# EAGLE schematic ControlBoardV3-4L (EAGLE 6.5.0)

## Sheet 1 of 4
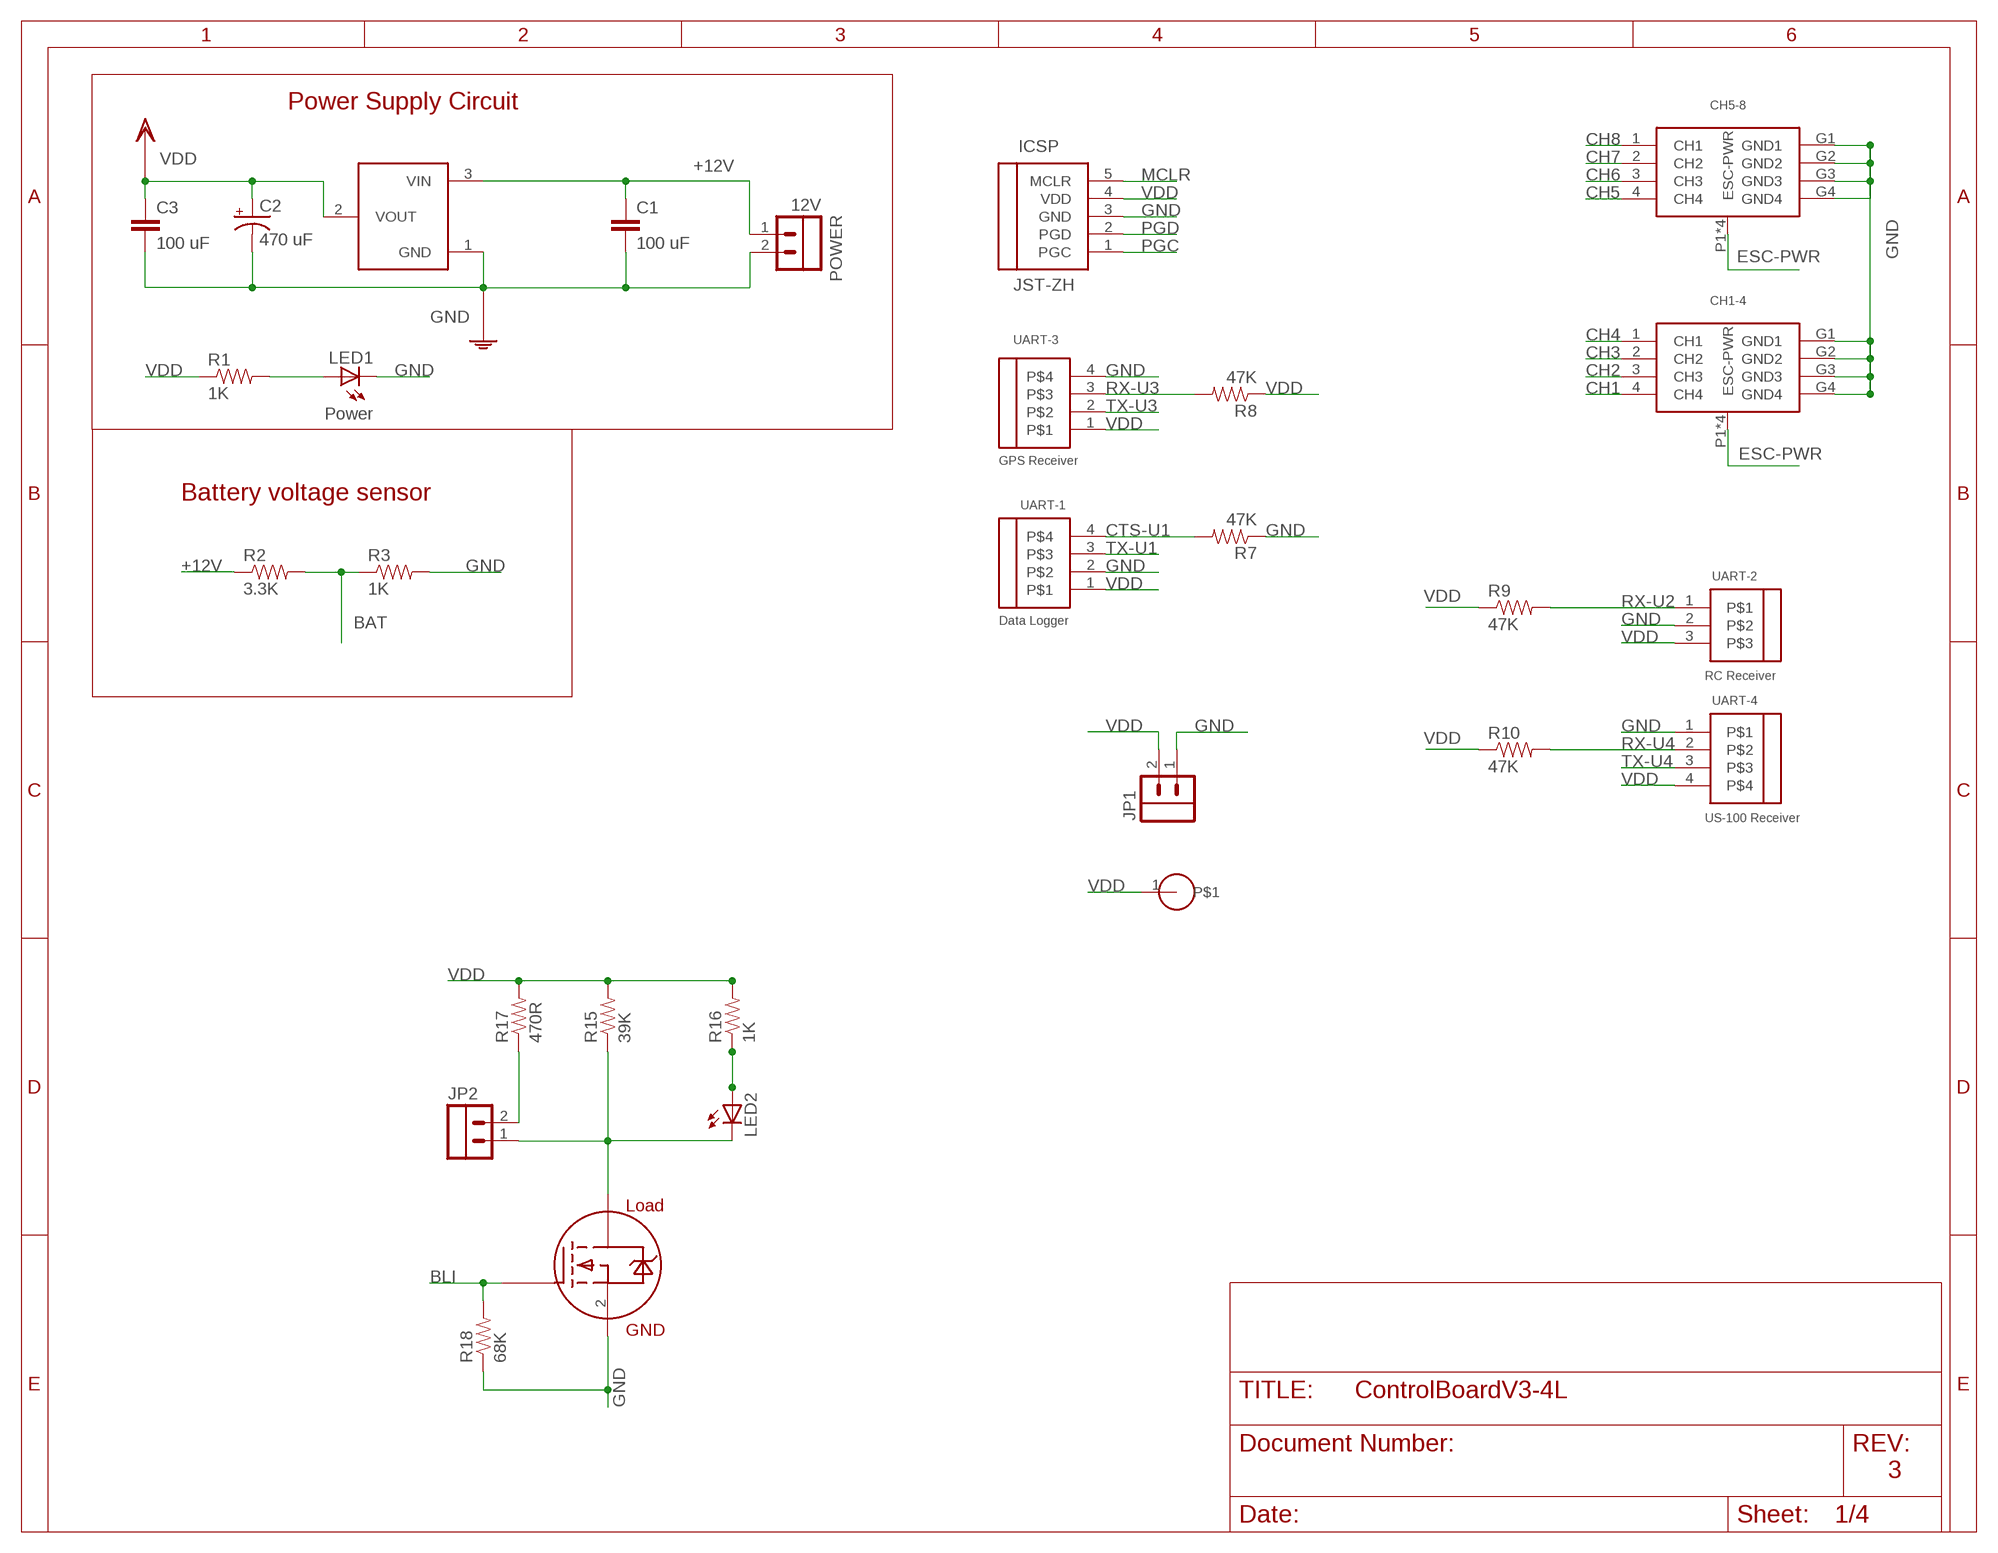
[diagram p0: schematic, sheet 1]

### Parts
C1  100 uF  CAP-CERAMIC_1210  [1210_INCH-HS-CAP]
C2  470 uF  CAP-SMD-TANT_D-7343  [TANT-D-7343]
C3  100 uF  CAP-CERAMIC_1210  [1210_INCH-HS-CAP]
CH1-4  4CH-PWM-PPM-HEADER  [4CH-PWM-PPM-HEADER-PACKAGE]
CH5-8  4CH-PWM-PPM-HEADER  [4CH-PWM-PPM-HEADER-PACKAGE]
ICSP  JST-ZH  ICSP_JST-ZH  [1X05-JST-ZH]
JP1  HEADER-02_JST_ZH  [1X02-JST-ZH]
JP2  HEADER-02_0.1"_NO_SILK  [1X02_100MIL_NO_SILK]
LED1  Power  LED_SMD_1206  [1206_INCH-HS-LED]
LED2  LED_SMD_1206  [1206_INCH-HS-LED]
POWER  12V  HEADER-02_0.1"_LONGPADS  [1X02_100MIL_LONGPADS]
R1  1K  RESISTOR_0805  [0805_INCH-HS]
R2  3.3K  RESISTOR_0805  [0805_INCH-HS]
R3  1K  RESISTOR_0805  [0805_INCH-HS]
R7  47K  RESISTOR_0805  [0805_INCH-HS]
R8  47K  RESISTOR_0805  [0805_INCH-HS]
R9  47K  RESISTOR_0805  [0805_INCH-HS]
R10  47K  RESISTOR_0805  [0805_INCH-HS]
R15  39K  RESISTOR_0805  [0805_INCH-HS]
R16  1K  RESISTOR_0805  [0805_INCH-HS]
R17  470R  RESISTOR_0805  [0805_INCH-HS]
R18  68K  RESISTOR_0805  [0805_INCH-HS]
U$2  NCP1117_DPAK  [DPAK-ONSEMI]
U$5  N-MOSFET_SOT-323  [SOT-323]
U$6  TAP-01_PRECISE  [1X01_PRECISE]
UART-1  Data Logger  HEADER-04_JST-ZH_JST-ZH  [1X04-JST-ZH]
UART-2  RC Receiver  HEADER-03_JST-ZH  [1X03-JST-ZH]
UART-3  GPS Receiver  HEADER-04_MOLEX-1.25  [1X04-MOLEX-PICOBLADE]
UART-4  US-100 Receiver  HEADER-04_JST-ZH_JST-ZH  [1X04-JST-ZH]

### Nets
+12V [Power]: C1.P$1 POWER.1 R2.1 U$2.3(VIN)
BAT: R2.2 R3.1 ; also sheet 2
BLI: R18.2 U$5.1(G) ; also sheet 2
CH1: CH1-4.4(CH4) ; also sheet 2
CH2: CH1-4.3(CH3) ; also sheet 2
CH3: CH1-4.2(CH2) ; also sheet 2
CH4: CH1-4.1(CH1) ; also sheet 2
CH5: CH5-8.4(CH4) ; also sheet 2
CH6: CH5-8.3(CH3) ; also sheet 2
CH7: CH5-8.2(CH2) ; also sheet 2
CH8: CH5-8.1(CH1) ; also sheet 2
CTS-U1: R7.2 UART-1.4 ; also sheet 2
ESC-PWR: CH1-4.P1(ESC-PWR) CH1-4.P2(ESC-PWR) CH1-4.P3(ESC-PWR) CH1-4.P4(ESC-PWR) CH5-8.P1(ESC-PWR) CH5-8.P2(ESC-PWR) CH5-8.P3(ESC-PWR) CH5-8.P4(ESC-PWR)
GND: C1.P$2 C2.- C3.P$2 CH1-4.G1(GND1) CH1-4.G2(GND2) CH1-4.G3(GND3) CH1-4.G4(GND4) CH5-8.G1(GND1) CH5-8.G2(GND2) CH5-8.G3(GND3) CH5-8.G4(GND4) ICSP.3(GND) JP1.1 LED1.C POWER.2 R3.2 R7.1 R18.1 U$2.1(GND) U$5.2(S) UART-1.2 UART-2.2 UART-3.4 UART-4.1 ; also sheet 2,3,4
MCLR: ICSP.5(MCLR) ; also sheet 2
N$2: LED1.A R1.2
N$11: JP2.2 R17.1
N$12: JP2.1 LED2.C R15.1 U$5.3(D)
N$13: LED2.A R16.1
PGC: ICSP.1(PGC) ; also sheet 2
PGD: ICSP.2(PGD) ; also sheet 2
RX-U2: R9.2 UART-2.1 ; also sheet 2
RX-U3: R8.2 UART-3.3 ; also sheet 2
RX-U4: R10.2 UART-4.2 ; also sheet 2
TX-U1: UART-1.3 ; also sheet 2
TX-U3: UART-3.2 ; also sheet 2
TX-U4: UART-4.3 ; also sheet 2
VDD: C2.+ C3.P$1 ICSP.4(VDD) JP1.2 R1.1 R8.1 R9.1 R10.1 R15.2 R16.2 R17.2 U$2.2(VOUT) U$6.1 UART-1.1 UART-2.3 UART-3.1 UART-4.4 ; also sheet 2,3,4

### Notes on the sheet
- Power Supply Circuit
- Battery voltage sensor
- 3

## Sheet 2 of 4
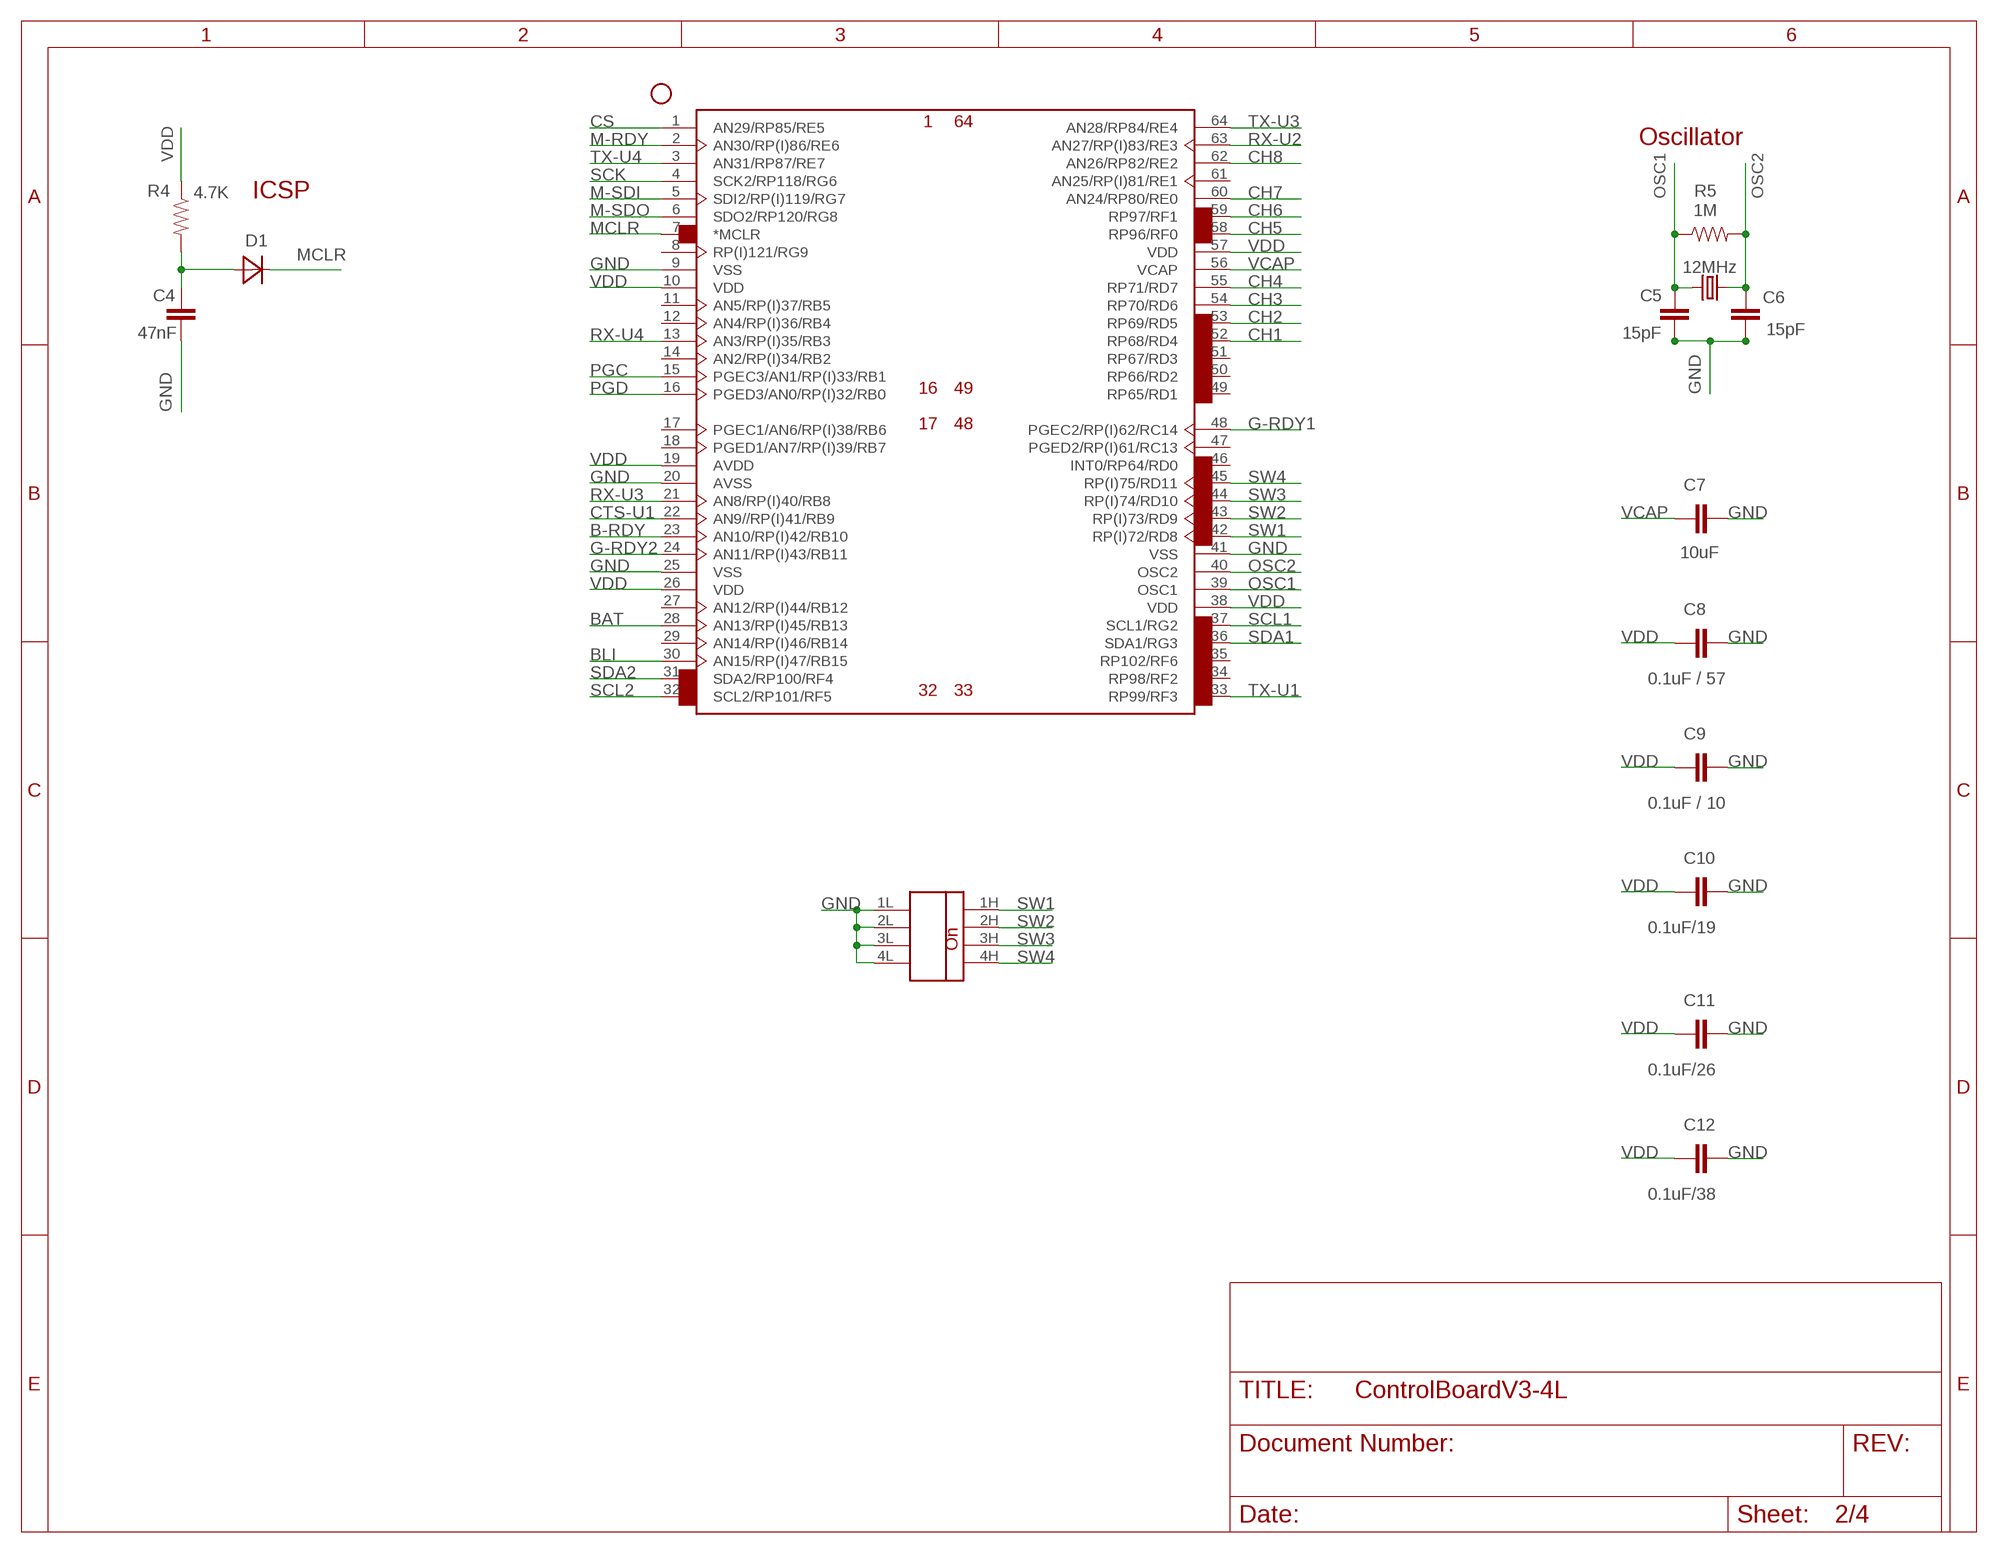
[diagram p1: schematic, sheet 2]

### Parts
C4  47nF  CAP-CERAMIC_0805  [0805_INCH-HS-CAP]
C5  15pF  CAP-CERAMIC_0805  [0805_INCH-HS-CAP]
C6  15pF  CAP-CERAMIC_0805  [0805_INCH-HS-CAP]
C7  10uF  CAP-CERAMIC_1210  [1210_INCH-HS-CAP]
C8  0.1uF / 57  CAP-CERAMIC_0603  [0603_INCH-HS-CAP]
C9  0.1uF / 10  CAP-CERAMIC_0603  [0603_INCH-HS-CAP]
C10  0.1uF/19  CAP-CERAMIC_0603  [0603_INCH-HS-CAP]
C11  0.1uF/26  CAP-CERAMIC_0603  [0603_INCH-HS-CAP]
C12  0.1uF/38  CAP-CERAMIC_0603  [0603_INCH-HS-CAP]
D1  DIODE_1206  [1206_INCH-HS-DIODE]
Q1  12MHz  CRYSTAL_SMD-5.0X3.2  [CRYSTAL-SMD-5.0X3.2]
R4  4.7K  RESISTOR_0805  [0805_INCH-HS]
R5  1M  RESISTOR_0805  [0805_INCH-HS]
U$1  PIC24EP512GP806_TQFP64-10X10  [TQFP64-10X10X1MM]
U$3  SWITCH-4_HALF-PITCH  [DIP-4-HP]

### Nets
B-RDY: U$1.23(AN10/RP(I)42/RB10) ; also sheet 4
BAT: U$1.28(AN13/RP(I)45/RB13) ; also sheet 1
BLI: U$1.30(AN15/RP(I)47/RB15) ; also sheet 1
CH1: U$1.52(RP68/RD4) ; also sheet 1
CH2: U$1.53(RP69/RD5) ; also sheet 1
CH3: U$1.54(RP70/RD6) ; also sheet 1
CH4: U$1.55(RP71/RD7) ; also sheet 1
CH5: U$1.58(RP96/RF0) ; also sheet 1
CH6: U$1.59(RP97/RF1) ; also sheet 1
CH7: U$1.60(AN24/RP80/RE0) ; also sheet 1
CH8: U$1.62(AN26/RP82/RE2) ; also sheet 1
CS: U$1.1(AN29/RP85/RE5) ; also sheet 3
CTS-U1: U$1.22(AN9//RP(I)41/RB9) ; also sheet 1
G-RDY1: U$1.48(PGEC2/RP(I)62/RC14) ; also sheet 3
G-RDY2: U$1.24(AN11/RP(I)43/RB11) ; also sheet 4
GND: C4.2 C5.1 C6.1 C7.P$2 C8.2 C9.2 C10.2 C11.2 C12.2 U$1.9(VSS) U$1.20(AVSS) U$1.25(VSS) U$1.41(VSS) U$3.1L U$3.2L U$3.3L U$3.4L ; also sheet 1,3,4
M-RDY: U$1.2(AN30/RP(I)86/RE6) ; also sheet 3
M-SDI: U$1.5(SDI2/RP(I)119/RG7) ; also sheet 3
M-SDO: U$1.6(SDO2/RP120/RG8) ; also sheet 3
MCLR: D1.C U$1.7(*MCLR) ; also sheet 1
N$14: C4.1 D1.A R4.2
OSC1: C5.2 Q1.P$2 R5.1 U$1.39(OSC1)
OSC2: C6.2 Q1.P$1 R5.2 U$1.40(OSC2)
PGC: U$1.15(PGEC3/AN1/RP(I)33/RB1) ; also sheet 1
PGD: U$1.16(PGED3/AN0/RP(I)32/RB0) ; also sheet 1
RX-U2: U$1.63(AN27/RP(I)83/RE3) ; also sheet 1
RX-U3: U$1.21(AN8/RP(I)40/RB8) ; also sheet 1
RX-U4: U$1.13(AN3/RP(I)35/RB3) ; also sheet 1
SCK: U$1.4(SCK2/RP118/RG6) ; also sheet 3
SCL1: U$1.37(SCL1/RG2) ; also sheet 3
SCL2: U$1.32(SCL2/RP101/RF5) ; also sheet 4
SDA1: U$1.36(SDA1/RG3) ; also sheet 3
SDA2: U$1.31(SDA2/RP100/RF4) ; also sheet 4
SW1: U$1.42(RP(I)72/RD8) U$3.1H
SW2: U$1.43(RP(I)73/RD9) U$3.2H
SW3: U$1.44(RP(I)74/RD10) U$3.3H
SW4: U$1.45(RP(I)75/RD11) U$3.4H
TX-U1: U$1.33(RP99/RF3) ; also sheet 1
TX-U3: U$1.64(AN28/RP84/RE4) ; also sheet 1
TX-U4: U$1.3(AN31/RP87/RE7) ; also sheet 1
VCAP: C7.P$1 U$1.56(VCAP)
VDD: C8.1 C9.1 C10.1 C11.1 C12.1 R4.1 U$1.10(VDD) U$1.19(AVDD) U$1.26(VDD) U$1.38(VDD) U$1.57(VDD) ; also sheet 1,3,4
Unconnected: U$1.8(RP(I)121/RG9) U$1.11(AN5/RP(I)37/RB5) U$1.12(AN4/RP(I)36/RB4) U$1.14(AN2/RP(I)34/RB2) U$1.17(PGEC1/AN6/RP(I)38/RB6) U$1.18(PGED1/AN7/RP(I)39/RB7) U$1.27(AN12/RP(I)44/RB12) U$1.29(AN14/RP(I)46/RB14) U$1.34(RP98/RF2) U$1.35(RP102/RF6) U$1.46(INT0/RP64/RD0) U$1.47(PGED2/RP(I)61/RC13) U$1.49(RP65/RD1) U$1.50(RP66/RD2) U$1.51(RP67/RD3) U$1.61(AN25/RP(I)81/RE1)

### Notes on the sheet
- Oscillator
- ICSP

## Sheet 3 of 4
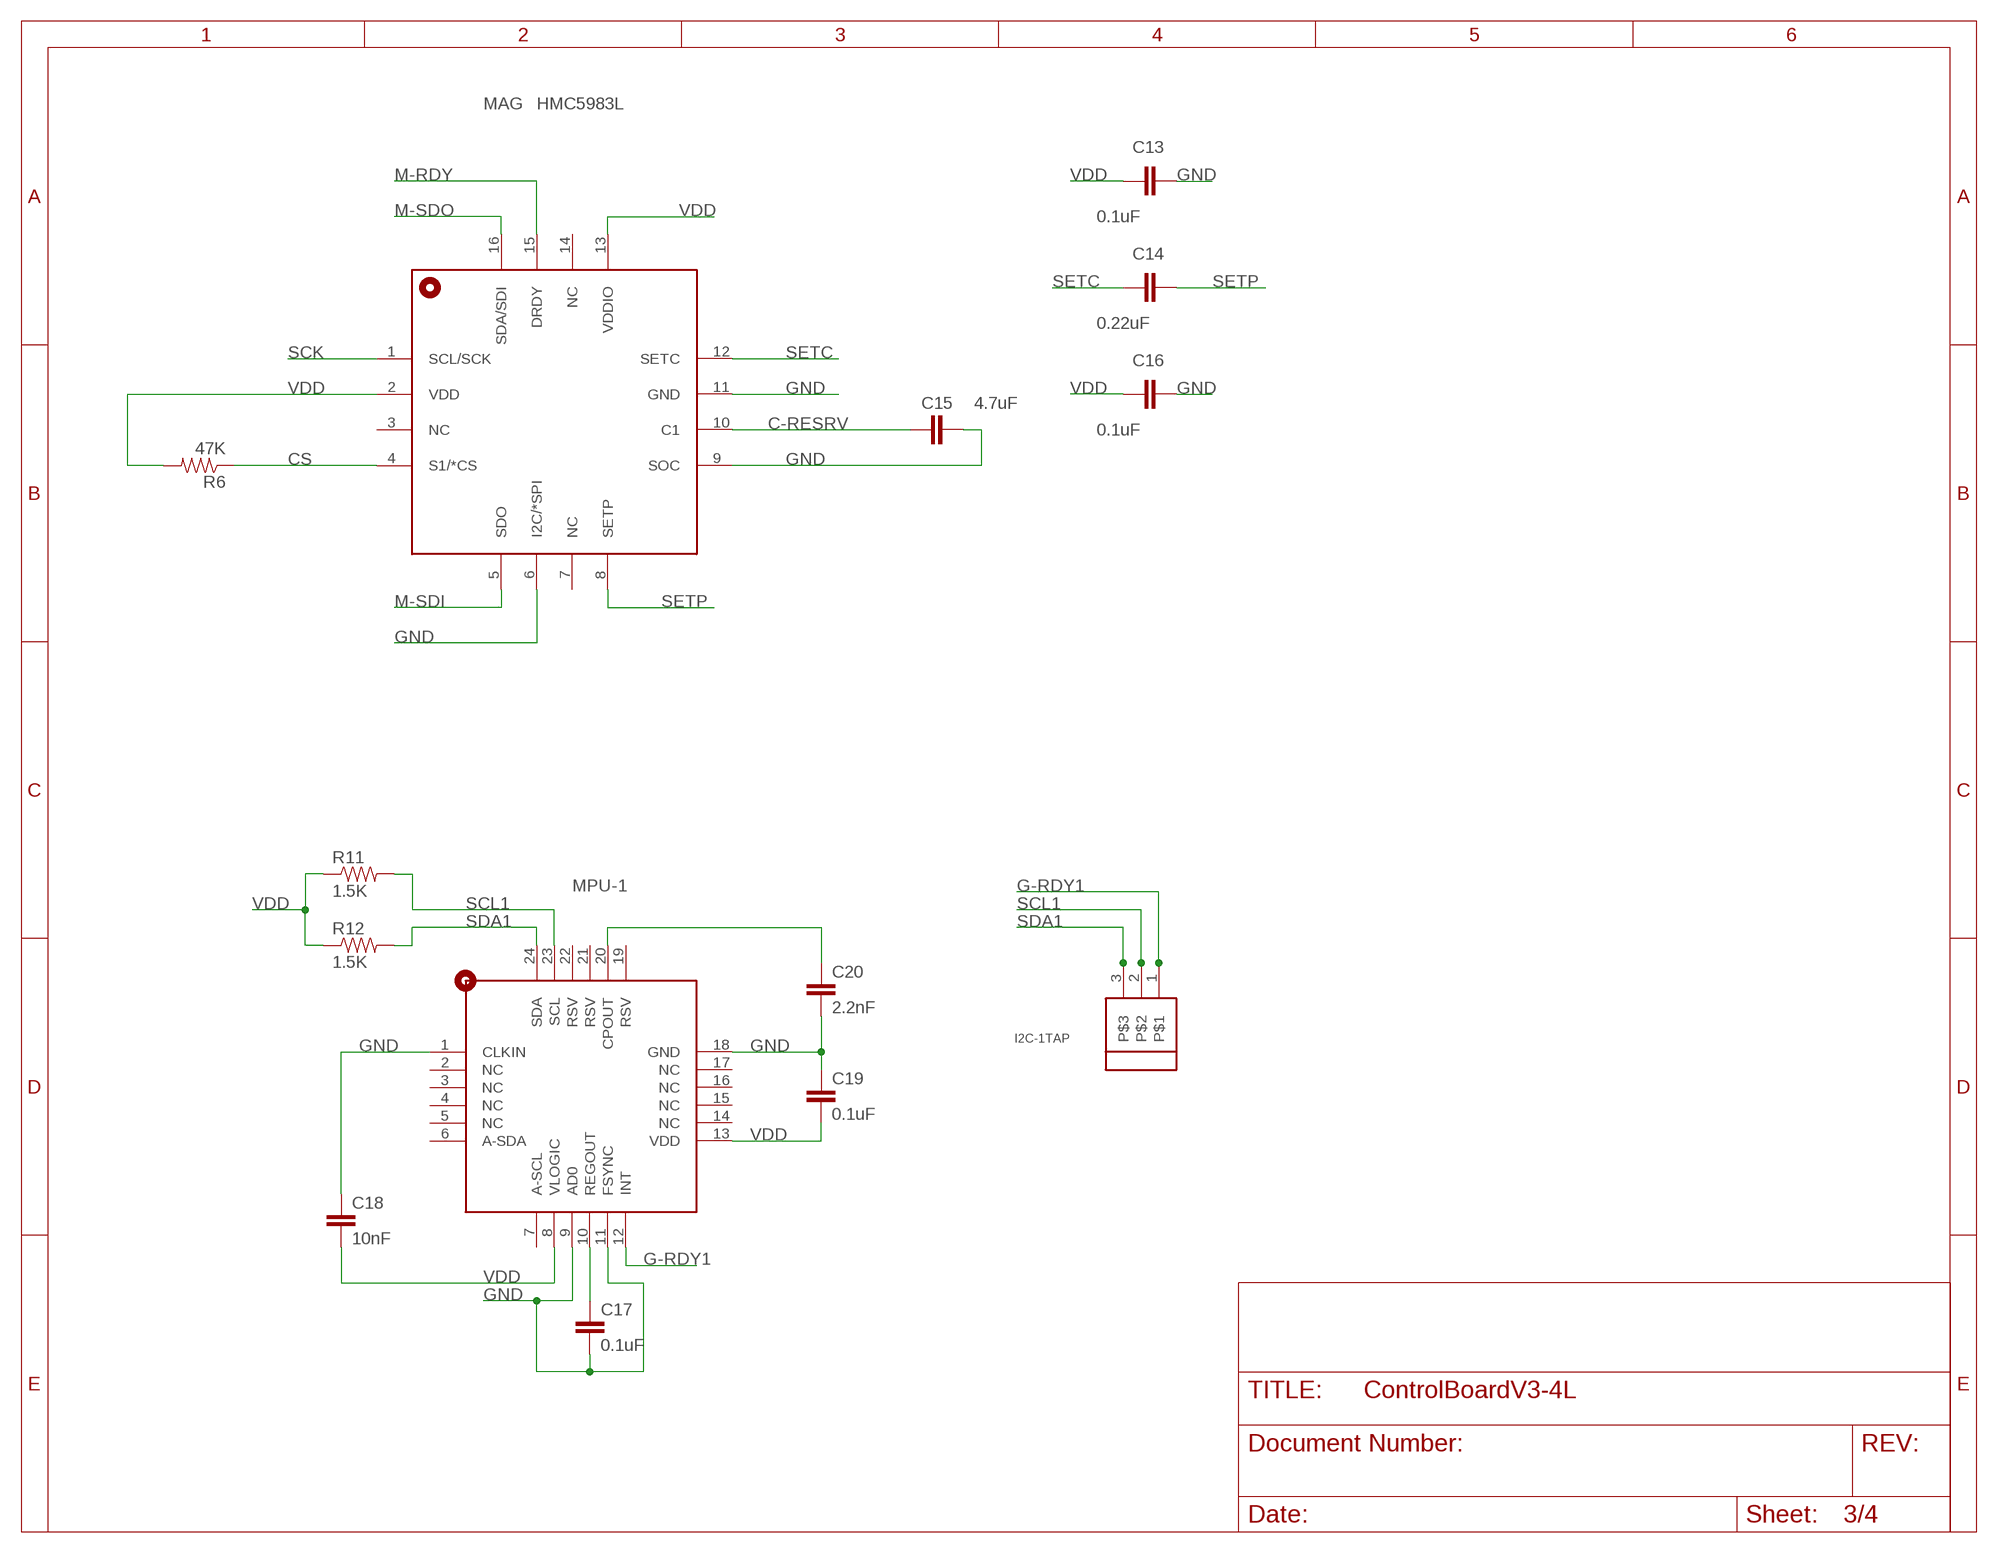
[diagram p2: schematic, sheet 3]

### Parts
C13  0.1uF  CAP-CERAMIC_0603  [0603_INCH-HS-CAP]
C14  0.22uF  CAP-CERAMIC_0603  [0603_INCH-HS-CAP]
C15  4.7uF  CAP-CERAMIC_0805  [0805_INCH-HS-CAP]
C16  0.1uF  CAP-CERAMIC_0603  [0603_INCH-HS-CAP]
C17  0.1uF  CAP-CERAMIC_0603  [0603_INCH-HS-CAP]
C18  10nF  CAP-CERAMIC_0603  [0603_INCH-HS-CAP]
C19  0.1uF  CAP-CERAMIC_0603  [0603_INCH-HS-CAP]
C20  2.2nF  CAP-CERAMIC_0805  [0805_INCH-HS-CAP]
I2C-1TAP  HEADER-03_MACHINED  [1X03-100MIL-MACHINED]
MAG  HMC5983L  HMC5983L_16PLCC  [HMC5X83L-16LPCC]
MPU-1  MPU-6050-1  [MPU-6050_QFN-24-4MM2_AZ]
R6  47K  RESISTOR_0805  [0805_INCH-HS]
R11  1.5K  RESISTOR_0805  [0805_INCH-HS]
R12  1.5K  RESISTOR_0805  [0805_INCH-HS]

### Nets
C-RESRV: C15.1 MAG.10(C1)
CS: MAG.4(S1/*CS) R6.1 ; also sheet 2
G-RDY1: I2C-1TAP.1 MPU-1.12(INT) ; also sheet 2
GND: C13.2 C15.2 C16.2 C17.2 C18.1 C19.1 C20.2 MAG.6(I2C/*SPI) MAG.9(SOC) MAG.11(GND) MPU-1.1(CLKIN) MPU-1.9(AD0) MPU-1.11(FSYNC) MPU-1.18(GND) ; also sheet 1,2,4
M-RDY: MAG.15(DRDY) ; also sheet 2
M-SDI: MAG.5(SDO) ; also sheet 2
M-SDO: MAG.16(SDA/SDI) ; also sheet 2
N$10: C17.1 MPU-1.10(REGOUT)
N$15: C20.1 MPU-1.20(CPOUT)
SCK: MAG.1(SCL/SCK) ; also sheet 2
SCL1: I2C-1TAP.2 MPU-1.23(SCL) R11.2 ; also sheet 2
SDA1: I2C-1TAP.3 MPU-1.24(SDA) R12.2 ; also sheet 2
SETC: C14.1 MAG.12(SETC)
SETP: C14.2 MAG.8(SETP)
VDD: C13.1 C16.1 C18.2 C19.2 MAG.2(VDD) MAG.13(VDDIO) MPU-1.8(VLOGIC) MPU-1.13(VDD) R6.2 R11.1 R12.1 ; also sheet 1,2,4
Unconnected: MAG.3(NC) MAG.7(NC) MAG.14(NC) MPU-1.2(NC) MPU-1.3(NC) MPU-1.4(NC) MPU-1.5(NC) MPU-1.6(A-SDA) MPU-1.7(A-SCL) MPU-1.14(NC) MPU-1.15(NC) MPU-1.16(NC) MPU-1.17(NC) MPU-1.19(RSV) MPU-1.21(RSV) MPU-1.22(RSV)

## Sheet 4 of 4
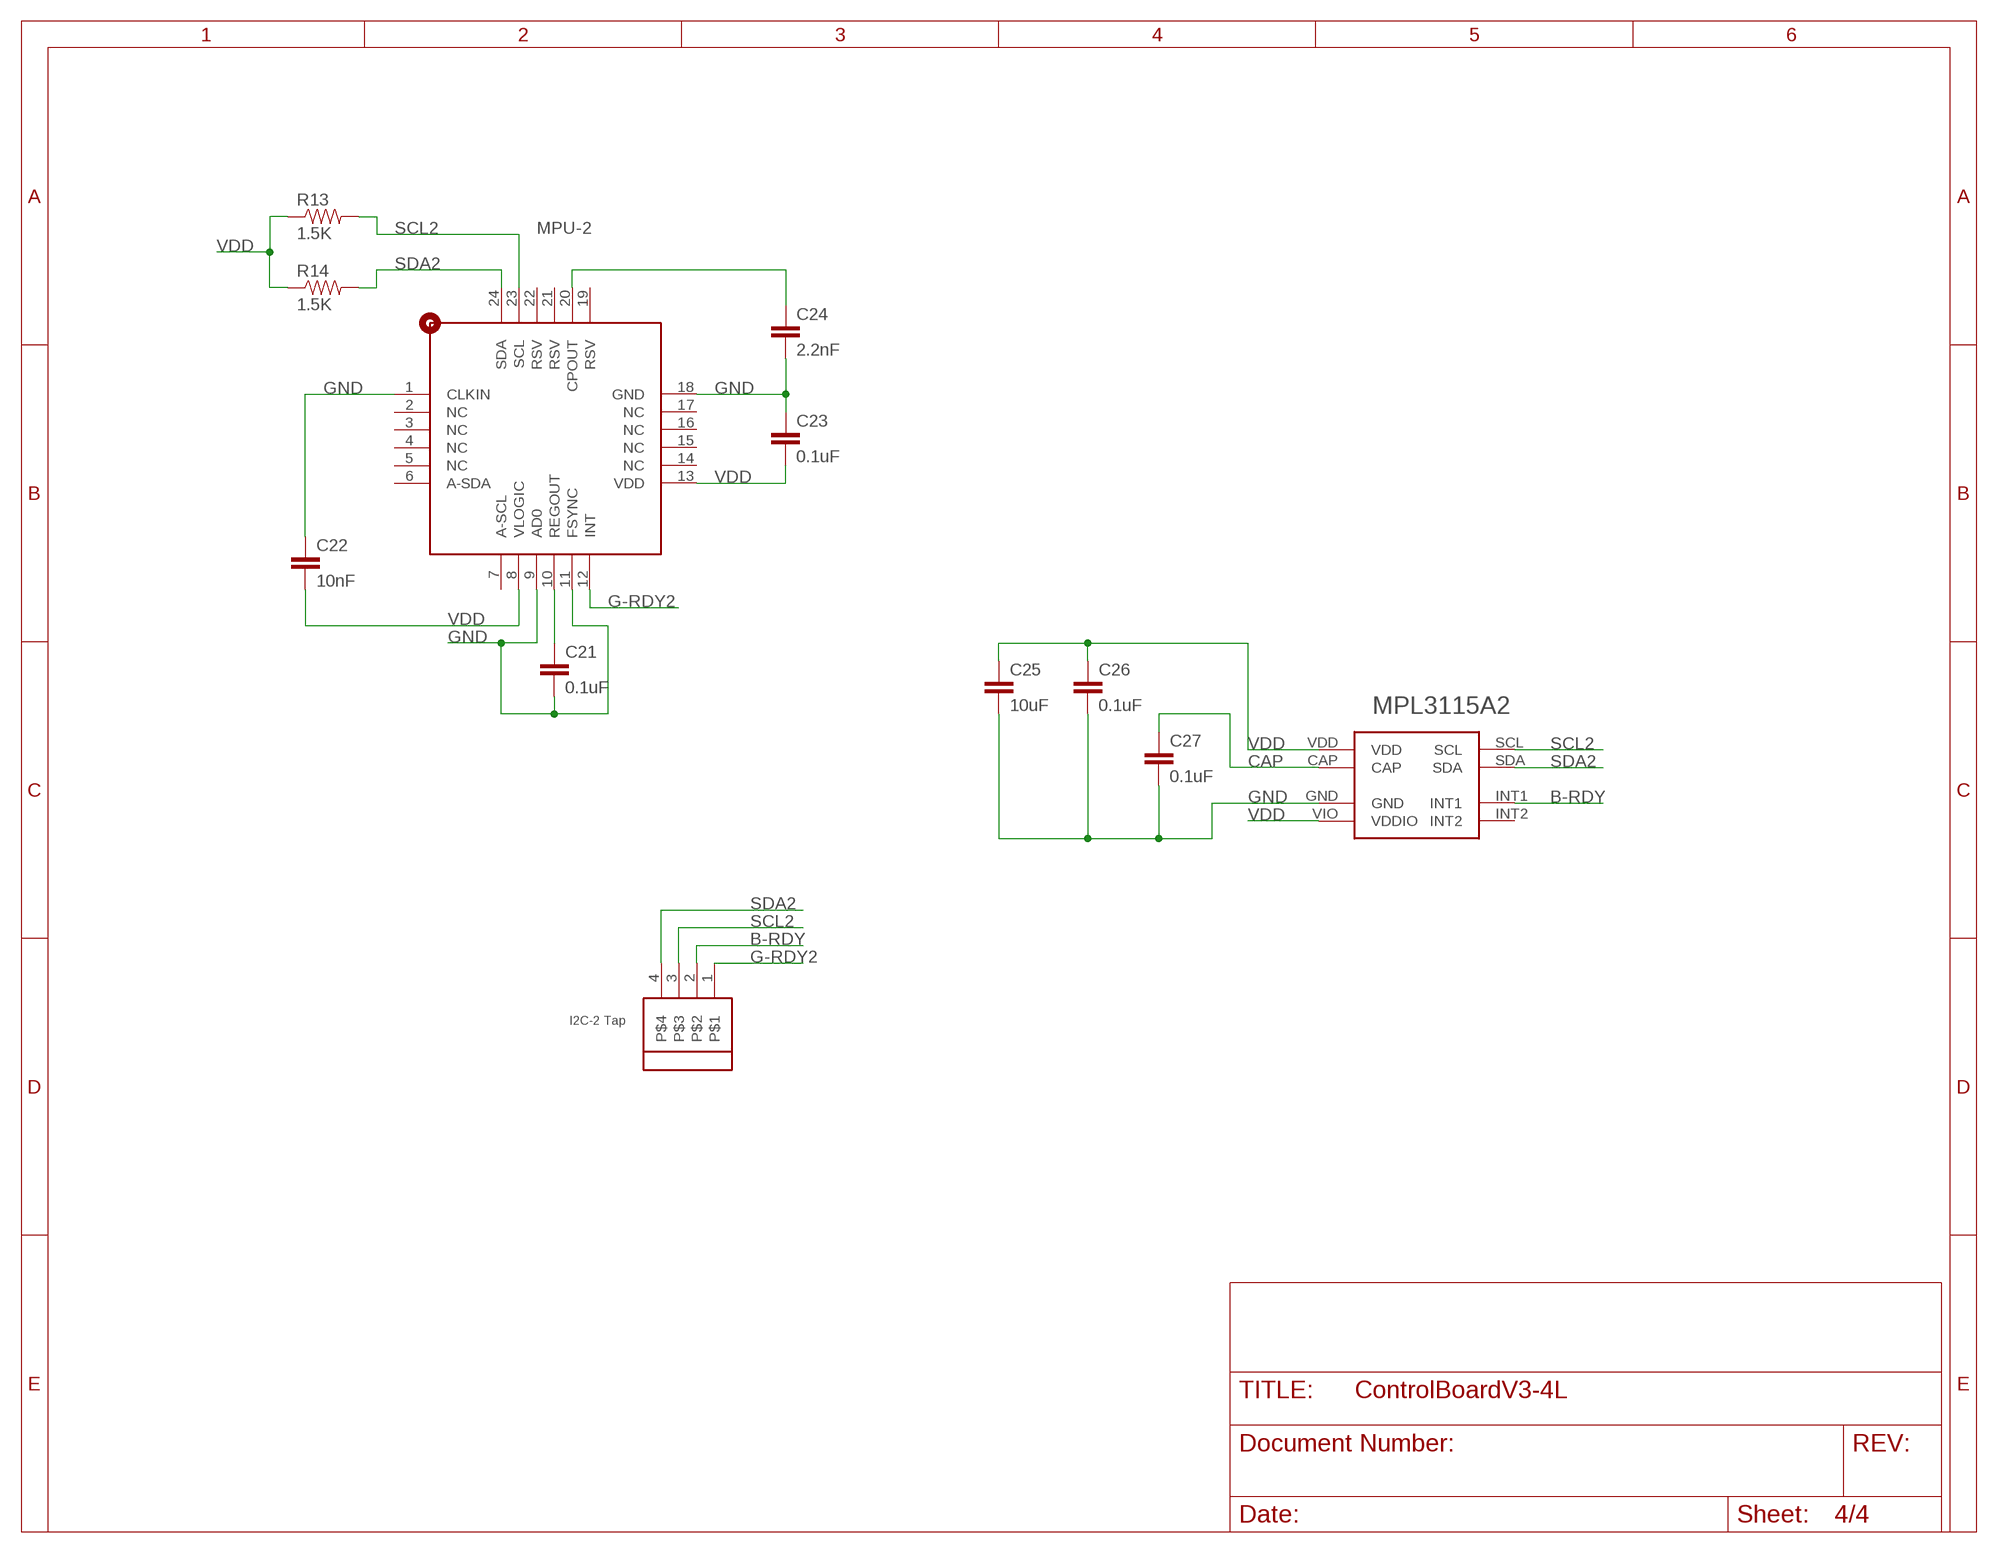
[diagram p3: schematic, sheet 4]

### Parts
C21  0.1uF  CAP-CERAMIC_0603  [0603_INCH-HS-CAP]
C22  10nF  CAP-CERAMIC_0603  [0603_INCH-HS-CAP]
C23  0.1uF  CAP-CERAMIC_0603  [0603_INCH-HS-CAP]
C24  2.2nF  CAP-CERAMIC_0805  [0805_INCH-HS-CAP]
C25  10uF  CAP-CERAMIC_1210  [1210_INCH-HS-CAP]
C26  0.1uF  CAP-CERAMIC_0603  [0603_INCH-HS-CAP]
C27  0.1uF  CAP-CERAMIC_0603  [0603_INCH-HS-CAP]
MPL3115A2  MPL-3115A2  [MPL-3115A2]
MPU-2  MPU-6050-1  [MPU-6050_QFN-24-4MM2_AZ]
R13  1.5K  RESISTOR_0805  [0805_INCH-HS]
R14  1.5K  RESISTOR_0805  [0805_INCH-HS]
U$4  I2C-2 Tap  HEADER-04_MACHINED  [1X04-100MIL-MACHINED]

### Nets
B-RDY: MPL3115A2.INT1 U$4.2 ; also sheet 2
CAP: C27.1 MPL3115A2.CAP
G-RDY2: MPU-2.12(INT) U$4.1 ; also sheet 2
GND: C21.2 C22.1 C23.1 C24.2 C25.P$2 C26.2 C27.2 MPL3115A2.GND MPU-2.1(CLKIN) MPU-2.9(AD0) MPU-2.11(FSYNC) MPU-2.18(GND) ; also sheet 1,2,3
N$6: C21.1 MPU-2.10(REGOUT)
N$7: C24.1 MPU-2.20(CPOUT)
SCL2: MPL3115A2.SCL MPU-2.23(SCL) R13.2 U$4.3 ; also sheet 2
SDA2: MPL3115A2.SDA MPU-2.24(SDA) R14.2 U$4.4 ; also sheet 2
VDD: C22.2 C23.2 C25.P$1 C26.1 MPL3115A2.VDD MPL3115A2.VIO(VDDIO) MPU-2.8(VLOGIC) MPU-2.13(VDD) R13.1 R14.1 ; also sheet 1,2,3
Unconnected: MPL3115A2.INT2 MPU-2.2(NC) MPU-2.3(NC) MPU-2.4(NC) MPU-2.5(NC) MPU-2.6(A-SDA) MPU-2.7(A-SCL) MPU-2.14(NC) MPU-2.15(NC) MPU-2.16(NC) MPU-2.17(NC) MPU-2.19(RSV) MPU-2.21(RSV) MPU-2.22(RSV)

## Library data of the parts
C1 C3-C27 = AZ Custom:CAP-CERAMIC: Ceramic Capacitor
C2 = AZ Custom:CAP-SMD-TANT
CH1-4 CH5-8 = AZ Custom:4CH-PWM-PPM-HEADER
D1 = AZ Custom:DIODE: Diode
I2C-1TAP UART-2 = AZ Custom:HEADER-03
ICSP = AZ Custom:ICSP: ICSP Header
JP1 JP2 POWER = AZ Custom:HEADER-02: Header 2 Standard 2-pin 0.1" header. Use with straight break away headers (SKU : PRT-00116), right angle break away headers (PRT-00553), swiss pins (PRT-00743), machine pins (PRT-00117), and female headers (PRT-00115). Molex polarized connector foot print use with SKU : PRT-08233 with associated crimp pins and housings.
LED1 LED2 = AZ Custom:LED: LEDs Standard schematic elements and footprints for 5mm, 3mm, 1206, and 0603 sized LEDs. 5mm - Spark Fun Electronics SKU : COM-00529 (and others)
MAG = AZ Custom:HMC5983L: HMC5983 I2C/SPI high-performance (up to 220 Hz) 3-axis magnetometer from Honeywell
MPL3115A2 = AZ Custom:MPL-3115A2
MPU-1 MPU-2 = AZ Custom:MPU-6050
Q1 = AZ Custom:CRYSTAL: Crystals Various standard crystals. Proven footprints. Spark Fun Electronics SKU : COM-00534
R1-R18 = AZ Custom:RESISTOR
U$1 = AZ Custom:PIC24EP512GP806: PIC24EP512GP806
U$2 = AZ Custom:NCP1117: On Semiconductor D-Pak Voltage Regulator LDO (08-1.0 V) voltage regulator providing up to 1 A regulated output Comes in multiple nominal voltages, in my stock - 3.3V
U$3 = AZ Custom:SWITCH-4: 4 contact pair switch
U$4 UART-1 UART-3 UART-4 = AZ Custom:HEADER-04
U$5 = AZ Custom:N-MOSFET: N-Channel MOSFET NOTE: Source is connected to Load (+), Drain is connected to GND. OFF when Gate at GND, ON when Gate at VDD (positive with respect to Drain)
U$6 = AZ Custom:TAP-01

## Net classes
0 default: width 0.178 mm, clearance 0.178 mm
1 Power: width 0.254 mm, clearance 0.178 mm
2 VDD-VSS: width 0.178 mm, clearance 0.178 mm